# Altium schematic sheet Socket-board.SchDoc
size A4
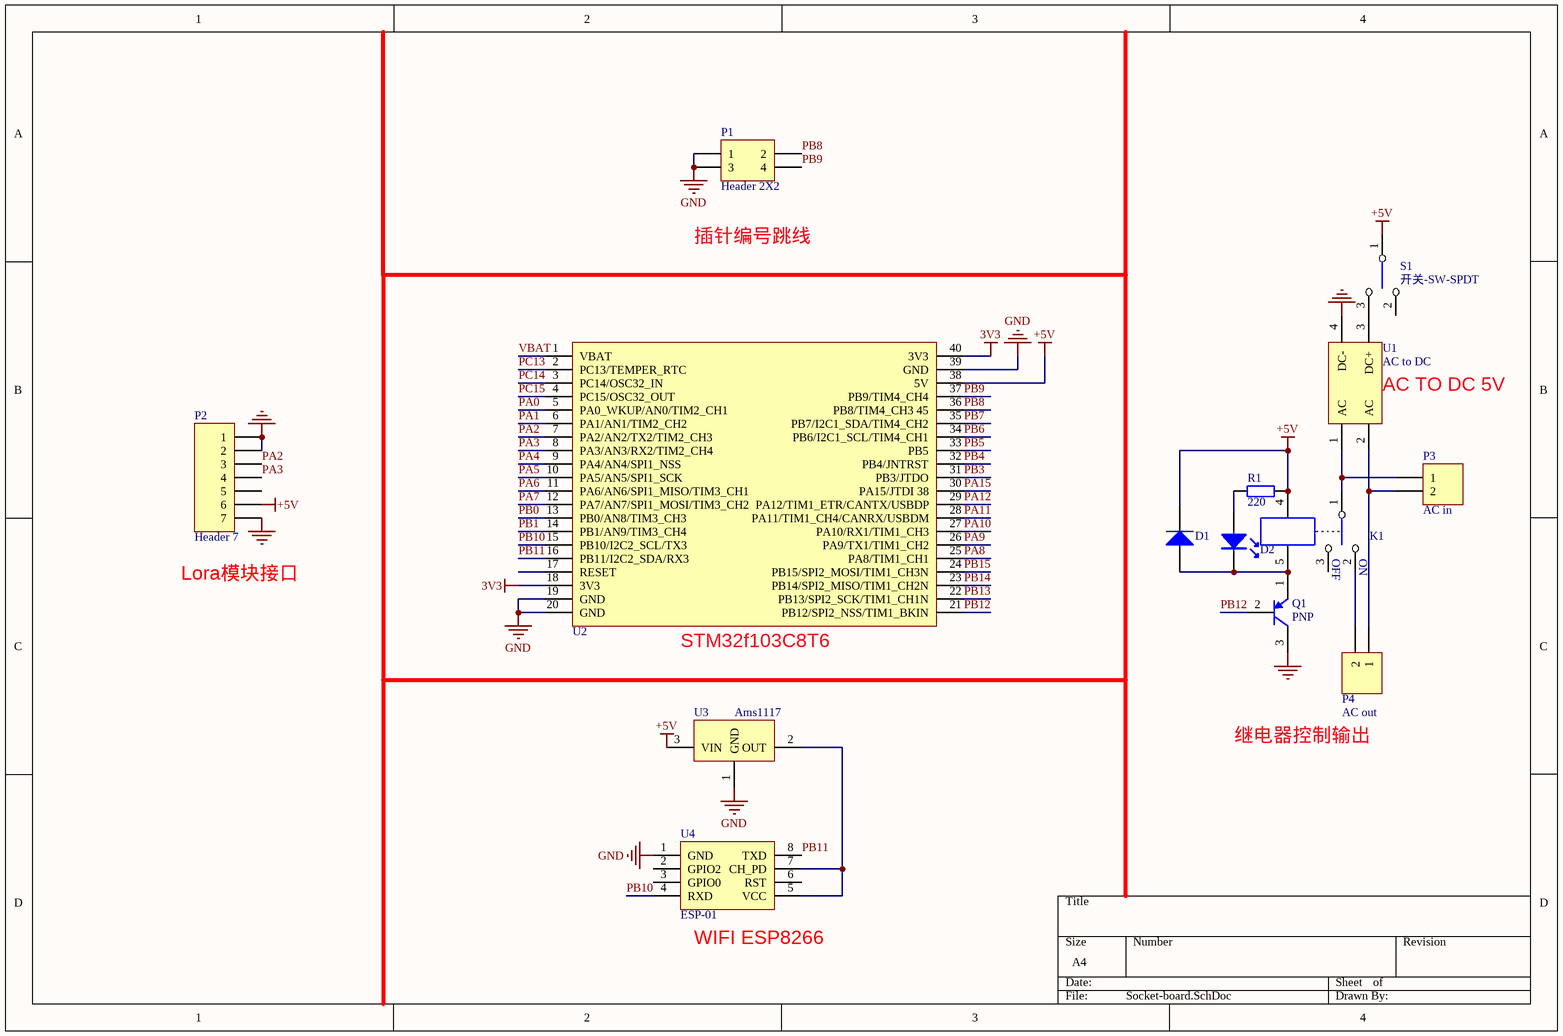
[diagram p0: Socket-board.SchDoc]

## Parts
D1  Diode 1N4001  [DO-41]  (value not drawn)
D2  二极管--发光  [LED-5]  (value not drawn)
K1  继电器-RELAY-3  [继电器5]  (value not drawn)
P1  Header 2X2  [HDR2X2]
P2  Header 7  [PE32(433T20DC)]
P3  AC in  [KF7.62-2P]
P4  AC out  [KF7.62-2P]
Q1  PNP  [TO-92B]
R1  value 220  [AXIAL-0.4]  (hidden comment: Res2)
S1  开关-SW-SPDT  [SW3]
U1  AC to DC  [艾尔塞VIPer12A]
U2  Core_STM32_YX  [Core_STM32_YX]  (value not drawn)
U3  Ams1117  [sot-223]
U4  ESP-01  [模块ESP8266]

## Nets
3V3: U2.18(3V3) U2.40(3V3)
+5V: D1.2(K) K1.4 P2.6 R1.1 S1.1 U2.38(5V) U3.3(VIN)
GND: P1.1 P1.3 P2.1 P2.2 P2.7 Q1.3(C) U1.4(DC-) U2.19(GND) U2.20(GND) U2.39(GND) U3.1(GND) U4.1(GND)
PA0: U2.5(PA0_WKUP/AN0/TIM2_CH1)
PA1: U2.6(PA1/AN1/TIM2_CH2)
PA2: P2.3 U2.7(PA2/AN2/TX2/TIM2_CH3)
PA3: P2.4 U2.8(PA3/AN3/RX2/TIM2_CH4)
PA4: U2.9(PA4/AN4/SPI1_NSS)
PA5: U2.10(PA5/AN5/SPI1_SCK)
PA6: U2.11(PA6/AN6/SPI1_MISO/TIM3_CH1)
PA7: U2.12(PA7/AN7/SPI1_MOSI/TIM3_CH2)
PA8: U2.25(PA8/TIM1_CH1)
PA9: U2.26(PA9/TX1/TIM1_CH2)
PA10: U2.27(PA10/RX1/TIM1_CH3)
PA11: U2.28(PA11/TIM1_CH4/CANRX/USBDM)
PA12: U2.29(PA12/TIM1_ETR/CANTX/USBDP)
PA15: U2.30(PA15/JTDI_38)
PB0: U2.13(PB0/AN8/TIM3_CH3)
PB1: U2.14(PB1/AN9/TIM3_CH4)
PB3: U2.31(PB3/JTDO)
PB4: U2.32(PB4/JNTRST)
PB5: U2.33(PB5)
PB6: U2.34(PB6/I2C1_SCL/TIM4_CH1)
PB7: U2.35(PB7/I2C1_SDA/TIM4_CH2)
PB8: P1.2 U2.36(PB8/TIM4_CH3_45)
PB9: P1.4 U2.37(PB9/TIM4_CH4)
PB10: U2.15(PB10/I2C2_SCL/TX3) U4.4(RXD)
PB11: U2.16(PB11/I2C2_SDA/RX3) U4.8(TXD)
PB12: Q1.2(B) U2.21(PB12/SPI2_NSS/TIM1_BKIN)
PB13: U2.22(PB13/SPI2_SCK/TIM1_CH1N)
PB14: U2.23(PB14/SPI2_MISO/TIM1_CH2N)
PB15: U2.24(PB15/SPI2_MOSI/TIM1_CH3N)
PC13: U2.2(PC13/TEMPER_RTC)
PC14: U2.3(PC14/OSC32_IN)
PC15: U2.4(PC15/OSC32_OUT)
VBAT: U2.1(VBAT)
NetD1_1: D1.1(A) D2.2 K1.5 Q1.1(E)
NetD2_1: D2.1 R1.2
NetK1_1: K1.1 P3.1 U1.1(AC)
NetK1_2: K1.2 P4.2
NetP3_2: P3.2 P4.1 U1.2(AC)
NetS1_3: S1.3 U1.3(DC+)
NetU3_2: U3.2(OUT) U4.5(VCC) U4.7(CH_PD)

Not connected (* = marked no-connect by the designer): K1 3; P2 5; S1 2; U2 17(RESET); U4 2(GPIO2) 3(GPIO0) 6(RST)

## Notes on the sheet
- 插针编号跳线
- (near U1) AC TO DC 5V
- (near P2) Lora模块接口
- (near U2) STM32f103C8T6
- 继电器控制输出
- (near U4) WIFI ESP8266
- (in symbol 继电器-RELAY-3) OFF; ON

## Library data of the parts
D1 = Diode 1N4001: 1 Amp General Purpose Rectifier; Published: 8-Jun-2000; LatestRevisionDate: 17-Jul-2002; LatestRevisionNote: Re-released for DXP Platform.; DatasheetDocument: 1998; PackageDocument: Aug-1999; PackageReference: DO-41; Publisher: Altium Limited; Code_JEDEC: DO-204-AL; ComponentLink1Description: Manufacturer Link; ComponentLink1URL: http://www.fairchildsemi.com/; ComponentLink2Description: Datasheet; ComponentLink2URL: http://www.fairchildsemi.com/ds/1N%2F1N4001.pdf
P1 = Header 2X2: Header, 2-Pin, Dual row; LatestRevisionDate: 17-Jul-2002; LatestRevisionNote: Re-released for DXP Platform.; Publisher: Altium Limited
P2 = Header 7: Header, 7-Pin; LatestRevisionDate: 17-Jul-2002; LatestRevisionNote: Re-released for DXP Platform.; Publisher: Altium Limited
P3 P4 = Header 2: Header, 2-Pin; LatestRevisionDate: 17-Jul-2002; LatestRevisionNote: Re-released for DXP Platform.; Publisher: Altium Limited
Q1 = 三极管-PNP
R1 = Res2: Resistor; Published: 8-Jun-2000; LatestRevisionDate: 17-Jul-2002; LatestRevisionNote: Re-released for DXP Platform.; PackageReference: AXIAL-0.4; Publisher: Altium Limited
U1 = 艾尔塞VIPer12A
U3 = 芯片-AMS1117
U4 = 模块ESP8266 ESP-01